# Altium project FMC_ADC_250M_16B_4ch.PrjPCB (part 3 of 4)

## Sheet Clock_Distribution.SchDoc
size A3
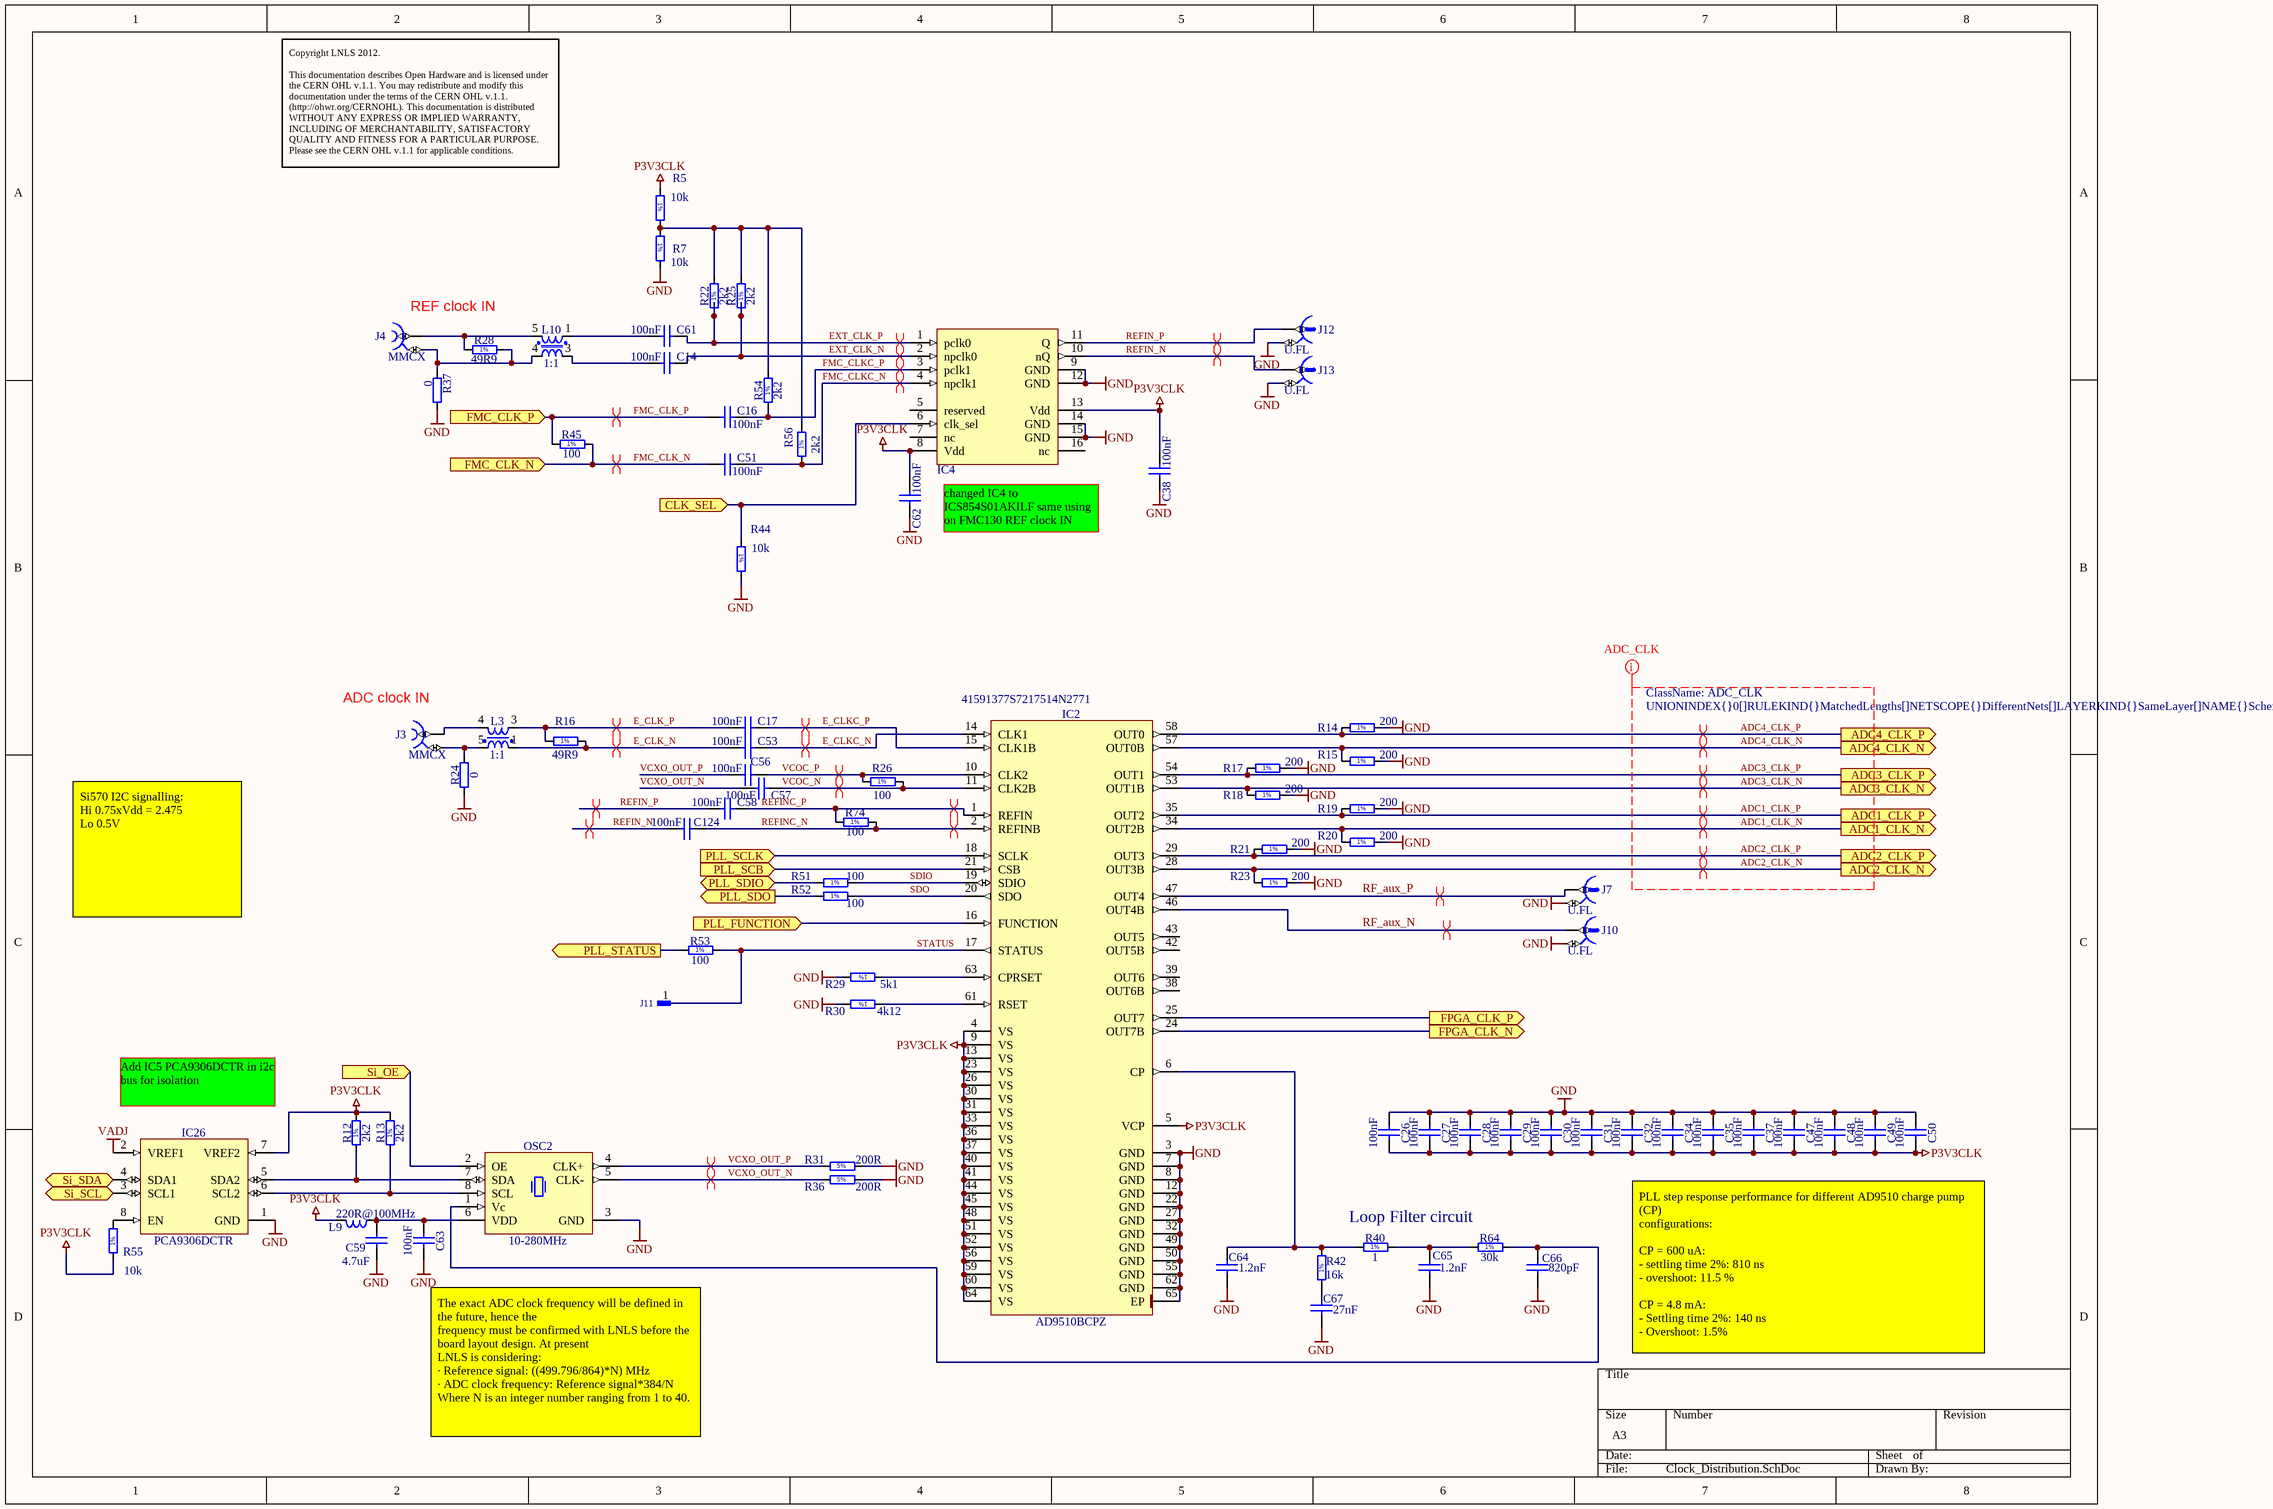
[diagram p5: Clock_Distribution.SchDoc]

### Parts
C14  100nF  [CAPC0603X33N]
C16  100nF  [CAPC0603X33N]
C17  100nF  [CAPC0603X33N]
C26  100nF  [CAPC0603X33N]
C27  100nF  [CAPC0603X33N]
C28  100nF  [CAPC0603X33N]
C29  100nF  [CAPC0603X33N]
C30  100nF  [CAPC0603X33N]
C31  100nF  [CAPC0603X33N]
C32  100nF  [CAPC0603X33N]
C34  100nF  [CAPC0603X33N]
C35  100nF  [CAPC0603X33N]
C37  100nF  [CAPC0603X33N]
C38  100nF  [CAPC0603X33N]
C47  100nF  [CAPC0603X33N]
C48  100nF  [CAPC0603X33N]
C49  100nF  [CAPC0603X33N]
C50  100nF  [CAPC0603X33N]
C51  100nF  [CAPC0603X33N]
C53  100nF  [CAPC0603X33N]
C56  100nF  [CAPC0603X33N]
C57  100nF  [CAPC0603X33N]
C58  100nF  [CAPC0603X33N]
C59  4.7uF  [CAPC1608X90N]
C61  100nF  [CAPC0603X33N]
C62  100nF  [CAPC0603X33N]
C63  100nF  [CAPC0603X33N]
C64  1.2nF  [CAPC1608X87N]
C65  1.2nF  [CAPC1608X87N]
C66  820pF  [CAPC1608X87N]
C67  27nF  [CAPC1608X87N]
C124  100nF  [CAPC0603X33N]
IC2  AD9510BCPZ  Supplier Part Number 1: 41591377S7217514N2771  [QFN50P900X900X100-65N-S485]
IC4  ICS854S01AKILF  [QFN50P300x300x100-17N-S140]  (value not drawn)
IC26  PCA9306DCTR  [SOP65P400X130-8N]
J3  MMCX  [HUBER-SUHNER_85_MMCX-50-0-1/111_OH]
J4  MMCX  [HUBER-SUHNER_85_MMCX-50-0-1/111_OH]
J7  U.FL  [HIROSE_U.FL-R-SMT-1(10)]
J10  U.FL  [HIROSE_U.FL-R-SMT-1(10)]
J11  SMD Pad  [R400X300]  (value not drawn)
J12  U.FL  [HIROSE_U.FL-R-SMT-1(10)]
J13  U.FL  [HIROSE_U.FL-R-SMT-1(10)]
L3  1:1  [XFMR_MA-COM_SM-22 (H260)]
L9  220R@100MHz  [INDC1005X55N]
L10  1:1  [XFMR_MA-COM_SM-22 (H260)]
OSC2  10-280MHz  [OSC_SILICON-LAB_SI571]
R5  10k  [RESC1005X40N]
R7  10k  [RESC1005X40N]
R12  2k2  [RESC1005X40N]
R13  2k2  [RESC1005X40N]
R14  200  [RESC1005X40N]
R15  200  [RESC1005X40N]
R16  49R9  [RESC1005X40N]
R17  200  [RESC1005X40N]
R18  200  [RESC1005X40N]
R19  200  [RESC1005X40N]
R20  200  [RESC1005X40N]
R21  200  [RESC1005X40N]
R22  2k2  [RESC1005X40N]
R23  200  [RESC1005X40N]
R24  0  [RESC0603X28N]
R25  2k2  [RESC1005X40N]
R26  100  [RESC1005X40N]
R28  49R9  [RESC1005X40N]
R29  5k1  [RESC1005X40N]
R30  4k12  [RESC1005X40N]
R31  200R  [RESC1005X40N]
R36  200R  [RESC1005X40N]
R37  0  [RESC0603X28N]
R40  1  [RESC1005X40N]
R42  16k  [RESC1608X55N]
R44  10k  [RESC1005X40N]
R45  100  [RESC1005X40N]
R51  100  [RESC1005X40N]
R52  100  [RESC1005X40N]
R53  100  [RESC1005X40N]
R54  2k2  [RESC1005X40N]
R55  10k  [RESC1005X40N]
R56  2k2  [RESC1005X40N]
R64  30k  [RESC1608X55N]
R74  100  [RESC1005X40N]

### Ports
ADC1_CLK_N (out), ADC1_CLK_P (out), ADC2_CLK_N (out), ADC2_CLK_P (out), ADC3_CLK_N (out), ADC3_CLK_P (out), ADC4_CLK_N (out), ADC4_CLK_P (out), CLK_SEL (in), FMC_CLK_N (in), FMC_CLK_P (in), FPGA_CLK_N (out), FPGA_CLK_P (out), PLL_FUNCTION (in), PLL_SCB (in), PLL_SCLK (in), PLL_SDIO (bidir), PLL_SDO (out), PLL_STATUS (out), Si_OE (in), Si_SCL (in), Si_SDA (bidir)

### Nets
GND: C26.1 C27.1 C28.1 C29.1 C30.1 C31.1 C32.1 C34.1 C35.1 C37.1 C38.1 C47.1 C48.1 C49.1 C50.1 C59.1 C62.1 C63.2 C64.1 C65.1 C66.1 C67.1 IC2.3(GND) IC2.7(GND) IC2.8(GND) IC2.12(GND) IC2.22(GND) IC2.27(GND) IC2.32(GND) IC2.49(GND) IC2.50(GND) IC2.55(GND) IC2.62(GND) IC2.65(EP) IC4.9(GND) IC4.12(GND) IC4.14(GND) IC4.15(GND) IC26.1(GND) J7.2 J10.2 J12.2 J13.2 OSC2.3(GND) R7.2 R14.2 R15.2 R17.2 R18.2 R19.2 R20.2 R21.2 R23.2 R24.1 R29.2 R30.2 R31.2 R36.2 R37.2 R44.2
P3V3CLK: C26.2 C27.2 C28.2 C29.2 C30.2 C31.2 C32.2 C34.2 C35.2 C37.2 C38.2 C47.2 C48.2 C49.2 C50.2 C62.2 IC2.4(VS) IC2.5(VCP) IC2.9(VS) IC2.13(VS) IC2.23(VS) IC2.26(VS) IC2.30(VS) IC2.31(VS) IC2.33(VS) IC2.36(VS) IC2.37(VS) IC2.40(VS) IC2.41(VS) IC2.44(VS) IC2.45(VS) IC2.48(VS) IC2.51(VS) IC2.52(VS) IC2.56(VS) IC2.59(VS) IC2.60(VS) IC2.64(VS) IC4.8(Vdd) IC4.13(Vdd) IC26.7(VREF2) L9.2 R5.1 R12.2 R13.2 R55.1
VADJ: IC26.2(VREF1)
ADC1_CLK_N: IC2.34(OUT2B) R20.1 ; port ADC1_CLK_N
ADC1_CLK_P: IC2.35(OUT2) R19.1 ; port ADC1_CLK_P
ADC2_CLK_N: IC2.28(OUT3B) R23.1 ; port ADC2_CLK_N
ADC2_CLK_P: IC2.29(OUT3) R21.1 ; port ADC2_CLK_P
ADC3_CLK_N: IC2.53(OUT1B) R18.1 ; port ADC3_CLK_N
ADC3_CLK_P: IC2.54(OUT1) R17.1 ; port ADC3_CLK_P
ADC4_CLK_N: IC2.57(OUT0B) R15.1 ; port ADC4_CLK_N
ADC4_CLK_P: IC2.58(OUT0) R14.1 ; port ADC4_CLK_P
CLK_SEL: IC4.6(clk_sel) R44.1 ; port CLK_SEL
E_CLK_N: C53.2 L3.1 R16.2
E_CLK_P: C17.2 L3.3 R16.1
E_CLKC_N: C53.1 IC2.14(CLK1)
E_CLKC_P: C17.1 IC2.15(CLK1B)
EXT_CLK_N: C14.1 IC4.2(npclk0) R25.1
EXT_CLK_P: C61.1 IC4.1(pclk0) R22.1
FMC_CLK_N: C51.2 R45.2 ; port FMC_CLK_N
FMC_CLK_P: C16.2 R45.1 ; port FMC_CLK_P
FMC_CLKC_N: C51.1 IC4.4(npclk1) R56.1
FMC_CLKC_P: C16.1 IC4.3(pclk1) R54.1
FPGA_CLK_N: IC2.24(OUT7B) ; port FPGA_CLK_N
FPGA_CLK_P: IC2.25(OUT7) ; port FPGA_CLK_P
PLL_FUNCTION: IC2.16(FUNCTION) ; port PLL_FUNCTION
PLL_SCB: IC2.21(CSB) ; port PLL_SCB
PLL_SCLK: IC2.18(SCLK) ; port PLL_SCLK
PLL_SDIO: R51.1 ; port PLL_SDIO
PLL_SDO: R52.1 ; port PLL_SDO
PLL_STATUS: R53.1 ; port PLL_STATUS
REFIN_N: C124.2 IC4.10(nQ) J13.1
REFIN_P: C58.2 IC4.11(Q) J12.1
REFINC_N: C124.1 IC2.2(REFINB) R74.2
REFINC_P: C58.1 IC2.1(REFIN) R74.1
RF_aux_N: IC2.46(OUT4B) J10.1
RF_aux_P: IC2.47(OUT4) J7.1
SDIO: IC2.19(SDIO) R51.2
SDO: IC2.20(SDO) R52.2
Si_OE: OSC2.2(OE) ; port Si_OE
Si_SCL: IC26.3(SCL1) ; port Si_SCL
Si_SDA: IC26.4(SDA1) ; port Si_SDA
STATUS: IC2.17(STATUS) J11.1 R53.2
VCOC_N: C57.1 IC2.11(CLK2B) R26.2
VCOC_P: C56.1 IC2.10(CLK2) R26.1
VCXO_OUT_N: C57.2 OSC2.5(CLK-) R36.1
VCXO_OUT_P: C56.2 OSC2.4(CLK+) R31.1
NetC14_2: C14.2 L10.3
NetC59_2: C59.2 C63.1 L9.1 OSC2.6(VDD)
NetC61_2: C61.2 L10.1
NetC64_2: C64.2 IC2.6(CP) R40.1 R42.2
NetC65_2: C65.2 R40.2 R64.1
NetC66_2: C66.2 OSC2.1(Vc) R64.2
NetC67_2: C67.2 R42.1
NetIC2_61: IC2.61(RSET) R30.1
NetIC2_63: IC2.63(CPRSET) R29.1
NetIC26_5: IC26.5(SDA2) OSC2.7(SDA) R12.1
NetIC26_6: IC26.6(SCL2) OSC2.8(SCL) R13.1
NetIC26_8: IC26.8(EN) R55.2
NetJ3_1: J3.1 L3.4
NetJ3_2: J3.2 L3.5 R24.2
NetJ4_1: J4.1 L10.5 R28.1
NetJ4_2: J4.2 L10.4 R28.2 R37.1
NetR5_2: R5.2 R7.1 R22.2 R25.2 R54.2 R56.2

Not connected (* = marked no-connect by the designer): IC2 38(OUT6B) 39(OUT6) 42(OUT5B) 43(OUT5); IC4 5(reserved) 7(nc) 16(nc)

### Layout directives
differential pair: ADC1_CLK_N, ADC1_CLK_P, ADC2_CLK_N, ADC2_CLK_P, ADC3_CLK_N, ADC3_CLK_P, ADC4_CLK_N, ADC4_CLK_P, E_CLK_N, E_CLK_P, E_CLKC_N, E_CLKC_P, EXT_CLK_N, EXT_CLK_P, FMC_CLK_N, FMC_CLK_P, FMC_CLKC_N, FMC_CLKC_P, REFIN_N, REFIN_P, REFINC_N, REFINC_P, RF_aux_N, RF_aux_P, VCOC_N, VCOC_P, VCXO_OUT_N, VCXO_OUT_P
net class ADC_CLK; rule Matched Net Lengths [Tolerance = 0.5mm]: ADC1_CLK_N, ADC1_CLK_P, ADC2_CLK_N, ADC2_CLK_P, ADC3_CLK_N, ADC3_CLK_P, ADC4_CLK_N, ADC4_CLK_P

### Notes on the sheet
- Copyright LNLS 2012.
  This documentation describes Open Hardware and is licensed under the CERN OHL v.1.1. You may redistribute and modify this documentation under the terms of the CERN OHL v.1.1. (http://ohwr.org/CERNOHL). This documentation is distributed WITHOUT ANY EXPRESS OR IMPLIED WARRANTY, INCLUDING OF MERCHANTABILITY, SATISFACTORY QUALITY AND FITNESS FOR A PARTICULAR PURPOSE. Please see the CERN OHL v.1.1 for applicable conditions.
- REF clock IN
- changed IC4 to ICS854S01AKILF same using on FMC130 REF clock IN
- (near J3) ADC clock IN
- Si570 I2C signalling:
  Hi 0.75xVdd = 2.475
  Lo 0.5V
- (near IC26) Add IC5 PCA9306DCTR in i2c bus for isolation
- Loop Filter circuit
- PLL step response performance for different AD9510 charge pump (CP)
  configurations:
  CP = 600 uA:
  - settling time 2%: 810 ns
  - overshoot: 11.5 %
  CP = 4.8 mA:
  - Settling time 2%: 140 ns
  - Overshoot: 1.5%
- (near C63) The exact ADC clock frequency will be defined in the future, hence the
  frequency must be confirmed with LNLS before the board layout design. At present
  LNLS is considering:
  · Reference signal: ((499.796/864)*N) MHz
  · ADC clock frequency: Reference signal*384/N
  Where N is an integer number ranging from 1 to 40.
- (in symbol R0402_1R_1%_0.0625W_200PPM) 1%
- (in symbol R0402_2K2_1%_0.0625W_100PPM) 1%
- (in symbol R0402_4K12_1%_0.0625W_100PPM) 1%
- (in symbol R0402_5K1_1%_0.0625W_100PPM) 1%
- (in symbol R0402_10K_1%_0.0625W_100PPM) 1%
- (in symbol R0402_49R9_1%_0.0625W_100PPM) 1%
- (in symbol R0402_100R_1%_0.0625W_100PPM) 1%
- (in symbol R0402_200R_1%_0.0625W_100PPM) 1%
- (in symbol R0603_16K_1%_0.1W_100PPM) 1%
- (in symbol R0603_30K_1%_0.1W_100PPM) 1%

### Library data of the parts
C14 C16 C17 C26-C32 C34 C35 C37 C38 C47-C51 C53 C56-C58 C61-C63 C124 = CC0201_100NF_6.3V_10%_X5R: Non-polarised capacitor; Part Description: SMD Multilayer Chip Ceramic Capacitor; Manufacturer: GENERIC; Manufacturer1 Part Number: 02016D104KAT2A; Voltage: 6.3V; TC: X5R; Tolerance: ±10%; Table: Capacitors SMD; Part Number: CC0201_100NF_6.3V_10%_X5R; Component Kind: Standard; Component Type: Standard; Pin Count: 2; Value: 100nF; Status: Not Recommended; Manufacturer Part Number: CC0201_100NF_6.3V_10%_X5R; Case: 0201; Mounted: Yes; Socket: No; SMD: Yes; Manufacturer1 Example: AVX; Manufacturer1 ComponentHeight: 0.33mm; HelpURL: \\cern.ch\dfs\Applications\Altium\Datasheets\CC0201_X5R_AVX.pdf; Author: CERN DEM JLC; CreateDate: 03/12/2007; LatestRevisionDate: 03/12/2007; Sense: No
C59 = CC0603_4.7UF_25V_10%_X5R: Non-polarised capacitor; Part Description: SMD Multilayer Chip Ceramic Capacitor; Manufacturer: GENERIC; Manufacturer1 Part Number: GRM188R61E475KE11D; Voltage: 25V; TC: X5R; Tolerance: ±10%; Part Number: CC0603_4.7UF_25V_10%_X5R; Component Kind: Standard; Component Type: Standard; Pin Count: 2; Value: 4.7uF; Status: None; Manufacturer Part Number: CC0603_4.7UF_25V_10%_X5R; Case: 0603; Mounted: Yes; Socket: No; SMD: Yes; Manufacturer1 Example: MURATA; Manufacturer1 ComponentHeight: 0.95mm; HelpURL: \\cern.ch\dfs\Applications\Altium\Datasheets\CC0603_MURATA_GRM188R61E475KE11D.pdf; Author: CERN DEM JLC; CreateDate: 10/11/2014; LatestRevisionDate: 10/11/2014; Sense: No
C64 C65 = CC0603_1.2NF_50V_10%_X7R: Non-polarised capacitor; Part Description: SMD Multilayer Chip Ceramic Capacitor; Manufacturer: GENERIC; Manufacturer1 Part Number: 223858615624; Voltage: 50V; TC: X7R; Tolerance: ±10%; Part Number: CC0603_1.2NF_50V_10%_X7R; Component Kind: Standard; Component Type: Standard; Pin Count: 2; Value: 1.2nF; Status: Preferred; Manufacturer Part Number: CC0603_1.2NF_50V_10%_X7R; Case: 0603; Mounted: Yes; Socket: No; SMD: Yes; Manufacturer1 Example: PHYCOMP; Manufacturer1 ComponentHeight: 0.87mm; HelpURL: \\cern.ch\dfs\Applications\Altium\Datasheets\CC0603_X7R_PHYCOMP.pdf; Author: CERN DEM JLC; CreateDate: 03/12/2007; LatestRevisionDate: 03/12/2007; Sense: No
C66 = CC0603_820PF_50V_10%_X7R: Non-polarised capacitor; Part Description: SMD Multilayer Chip Ceramic Capacitor; Manufacturer: GENERIC; Manufacturer1 Part Number: 223858615622; Voltage: 50V; TC: X7R; Tolerance: ±10%; Part Number: CC0603_820PF_50V_10%_X7R; Component Kind: Standard; Component Type: Standard; Pin Count: 2; Value: 820pF; Status: Preferred; Manufacturer Part Number: CC0603_820PF_50V_10%_X7R; Case: 0603; Mounted: Yes; Socket: No; SMD: Yes; Manufacturer1 Example: PHYCOMP; Manufacturer1 ComponentHeight: 0.87mm; Author: CERN DEM JLC; CreateDate: 03/12/2007; LatestRevisionDate: 03/12/2007; Sense: No; HelpURL: \\cern.ch\dfs\Applications\Altium\Datasheets\CC0603_X7R_PHYCOMP.pdf
C67 = CC0603_27NF_25V_10%_X7R: Non-polarised capacitor; Part Description: SMD Multilayer Chip Ceramic Capacitor; Manufacturer: GENERIC; Manufacturer1 Part Number: 223891615642; Voltage: 25V; TC: X7R; Tolerance: ±10%; Part Number: CC0603_27NF_25V_10%_X7R; Component Kind: Standard; Component Type: Standard; Pin Count: 2; Value: 27nF; Status: Preferred; Manufacturer Part Number: CC0603_27NF_25V_10%_X7R; Case: 0603; Mounted: Yes; Socket: No; SMD: Yes; Manufacturer1 Example: PHYCOMP; Manufacturer1 ComponentHeight: 0.87mm; HelpURL: \\cern.ch\dfs\Applications\Altium\Datasheets\CC0603_X7R_PHYCOMP.pdf; Author: CERN DEM JLC; CreateDate: 03/12/2007; LatestRevisionDate: 03/12/2007; Sense: No
IC2 = AD9510BCPZ: 1.2 GHz Clock Distribution IC, PLL Core, Dividers, Delay Adjust, Eight Outputs; Manufacturer: ANALOG DEVICES; Table: Logic; Bonding: No; PressFit: No; Part Number: AD9510BCPZ; Component Kind: Standard; Component Type: Standard; Device: AD9510BCPZ; PackageDescription: QFN, 0.50mm Pitch, Square; 64 Pin, 9.00mm L X 9.00mm W X 1.00mm H Body (4.85 X 4.85mm Thermal Tab), IPC Medium Density; Part Description: 1.2 GHz Clock Distribution IC, PLL Core, Dividers, Delay Adjust, Eight Outputs; Manufacturer Part Number: AD9510BCPZ; Pin Count: 65; Case: QFN64; Mounted: Yes; Socket: No; SMD: Yes; ComponentHeight: 1mm; HelpURL: \\cern.ch\dfs\Applications\Altium\Datasheets\AD9510BCPZ.pdf; Author: CERN DEM JLC; CreateDate: 09/10/2012; LatestRevisionDate: 09/10/2012; Supplier 1: Arrow; Sense: No
IC4 = ICS854S01AKILF: 2:1 Differential-to-LVDS Multiplexer; Manufacturer: INTEGRATED DEVICE TECHNOLOGY (IDT); PressFit: No; Bonding: No; Manufacturer Part Number: ICS854S01AKILF; Part Number: ICS854S01AKILF; Component Kind: Standard; Component Type: Standard; Device: ICS854S01AKILF; PackageDescription: QFN, 0.50mm Pitch, Square; 16 Pin, 3.00mm L X 3.00mm W X 1.00mm H Body (w/Thermal Tab 1.00 X 1.80mm),  IPC Medium Density; Part Description: 2:1 Differential-to-LVDS Multiplexer; Pin Count: 16; Case: QFN16; Mounted: Yes; Socket: No; SMD: Yes; Sense: No; ComponentHeight: 1.0mm; Author: LNLS DIG GBMB; CreateDate: 03/06/2016; LatestRevisionDate: 03/06/2016
IC26 = PCA9306DCTR: Dual Bidirectional I2C Bus And SMBus Voltage-Level Translator; Manufacturer: TEXAS INSTRUMENTS; Table: Analog & Interface; Bonding: No; PressFit: No; Part Number: PCA9306DCTR; Component Kind: Standard; Component Type: Standard; Device: PCA9306DCTR; PackageDescription: SOP, 0.65mm, Pitch; 8 Pin, 2.80mm W X 2.95mm L X 1.30mm H Body, PC Medium Density; Part Description: Dual Bidirectional I2C Bus And SMBus Voltage-Level Translator; Manufacturer Part Number: PCA9306DCTR; Pin Count: 8; Case: SSOP8; Mounted: Yes; Socket: No; SMD: Yes; ComponentHeight: 1.3mm; Author: CERN DEM JLC; HelpURL: \\cern.ch\dfs\Applications\Altium\Datasheets\PCA9306DCTR.pdf; CreateDate: 25/02/2013; LatestRevisionDate: 11/02/2016; Sense: No
J3 J4 = HUBER-SUHNER_85_MMCX-50-0-1/111_OH: Part Description: MMCX 50 Ohms Right Angle PCB Jack; Manufacturer: HUBER+SUHNER; PressFit: No; Part Number: HUBER-SUHNER_85_MMCX-50-0-1/111_OH; Component Kind: Standard; Component Type: Standard; Pin Count: 2; Family: MMCX; Mounted: Yes; Socket: No; SMD: No; Status: None; Manufacturer Part Number: 85_MMCX-50-0-1/111_OH; ComponentHeight: 9.6mm; HelpURL: \\cern.ch\dfs\Applications\Altium\Datasheets\HUBER-SUHNER_85_MMCX-50-0-1-111_OH.pdf; Author: CERN DEM JLC; CreateDate: 04/10/2011; LatestRevisionDate: 06/11/2014; Sense: No
J7 J10 J12 J13 = HIROSE_U.FL-R-SMT-1(10): Part Description: Up to 6GHz Ultra Small Surface Mount Male Coaxial Connectors U.FL Series; Manufacturer: HIROSE (HRS); Table: Miscellaneous; PressFit: No; Part Number: HIROSE_U.FL-R-SMT-1(10); Component Kind: Standard; Component Type: Standard; Pin Count: 2; Family: U.FL; Mounted: Yes; Socket: No; SMD: Yes; Status: None; Manufacturer Part Number: U.FL-R-SMT-1(10); ComponentHeight: 1.25mm; HelpURL: \\cern.ch\dfs\Applications\Altium\Datasheets\HIROSE_U.FL-R-SMT-1(10).pdf; Author: CERN DEM JLC; CreateDate: 24/03/2010; LatestRevisionDate: 24/03/2010; Sense: No
J11 = SMD_PAD_4X3MM: Single SMD Pad; Part Description: 4mm x 3mm SMD Pad; Mounted: No; Part Number: SMD_PAD_4X3MM; Component Kind: Standard (No BOM); Component Type: Standard (No BOM); Pin Count: 1; Family: SMD Pad; Socket: No; SMD: No; Sense: No; Status: None; ComponentHeight: 0mm; HelpURL: Undefined; Author: CERN DEM JLC; CreateDate: 15/03/2010; LatestRevisionDate: 15/03/2010; PackageDescription: 4mm x  3mm SMD Pad
L3 L10 = XFMR_MA-COM_MABA-007159-000000: MA-COM E-Serie RF 1:1 Transmission Line Ttransformer 4.5-3000MHz; Part Description: RF Transmission Line Ttransformer 4.5-3000MHz (E-Serie); Manufacturer: MA-COM TECHNOLOGY; Table: Transformers; Part Number: XFMR_MA-COM_MABA-007159-000000; Component Kind: Standard; Component Type: Standard; Pin Count: 5; Value: 1:1; Status: None; Manufacturer Part Number: MABA-007159-000000; Mounted: Yes; Socket: No; SMD: Yes; ComponentHeight: 2.6mm; HelpURL: \\cern.ch\dfs\Applications\Altium\Datasheets\XFMR_MA-COM_MABA-007159-000000.pdf; Author: CERN DEM JLC; CreateDate: 03/10/2012; LatestRevisionDate: 03/10/2012; Sense: No
L9 = IND0402_MURATA_BLM15HB221SN1: Inductor; Part Description: SMD EMIFIL Suppression Chip Ferrite Bead; Manufacturer: MURATA; Power: 250mA; Resistance: 1R; Tolerance: ±25%; Table: Inductors SMD; Part Number: IND0402_MURATA_BLM15HB221SN1; Component Kind: Standard; Component Type: Standard; Pin Count: 2; Value: 220R@100MHz; Status: None; Manufacturer Part Number: BLM15HB221SN1; Case: 0402; Mounted: Yes; Socket: No; SMD: Yes; ComponentHeight: 0.55mm; HelpURL: \\cern.ch\dfs\Applications\Altium\Datasheets\IND0402_MURATA_BLM15H.pdf; Author: CERN DEM JLC; CreateDate: 23/06/2009; LatestRevisionDate: 23/06/2009; Sense: No
OSC2 = OSC_10-280MHZ_SILICON-LAB_Si571AJC000337DG: Any-Rate I2C Programmable XO Oscillator Si571 Serie; Part Description: 10-280MHz 3.3V ±20ppm LVPECL, I2C Programmable VCXO Oscillator Si571 Series; Manufacturer: SILICON LABS; Bonding: No; PressFit: No; Part Number: OSC_10-280MHZ_SILICON-LAB_Si571AJC000337DG; Component Kind: Standard; Component Type: Standard; PackageDescription: Oscillator Si571 Series, 8 pins, 5x7mm; Value: 10-280MHz; Manufacturer Part Number: Si571AJC000337DG; Pin Count: 8; Mounted: Yes; Socket: No; SMD: Yes; ComponentHeight: 1.85mm; HelpURL: \\cern.ch\dfs\Applications\Altium\Datasheets\OSC_SILICON-LAB_SI571.pdf; Author: CERN DEM JLC; CreateDate: 07/07/2014; LatestRevisionDate: 07/07/2014; Sense: No
R5 R7 R44 R55 = R0402_10K_1%_0.0625W_100PPM: Resistor - 1%; Part Description: General Purpose Thick Film Chip Resistor; Manufacturer: GENERIC; Manufacturer1 Part Number: 232270671003L; TC: ±100ppm/°C; LatestRevisionDate: 17/10/2012; Part Number: R0402_10K_1%_0.0625W_100PPM; Component Kind: Standard; Component Type: Standard; Pin Count: 2; Value: 10k; Status: Not recommended; Power: 0.0625W; Tolerance: ±1%; Manufacturer Part Number: R0402_10K_1%_0.0625W_100PPM; Case: 0402; Mounted: Yes; Sense: No; Socket: No; SMD: Yes; Manufacturer1 Example: YAGEO PHYCOMP; Manufacturer1 ComponentHeight: 0.4mm; HelpURL: \\cern.ch\dfs\Applications\Altium\Datasheets\R0402_Phycomp_RC0402.pdf; Author: CERN DEM JLC; CreateDate: 03/12/2007
R12 R13 R22 R25 R54 R56 = R0402_2K2_1%_0.0625W_100PPM: Resistor - 1%; Part Description: General Purpose Thick Film Chip Resistor; Manufacturer: GENERIC; Manufacturer1 Part Number: 232270672202L; TC: ±100ppm/°C; Table: Resistors SMD; Part Number: R0402_2K2_1%_0.0625W_100PPM; Component Kind: Standard; Component Type: Standard; Pin Count: 2; Value: 2k2; Status: Not recommended; Power: 0.0625W; Tolerance: ±1%; Manufacturer Part Number: R0402_2K2_1%_0.0625W_100PPM; Case: 0402; Mounted: Yes; Socket: No; SMD: Yes; Manufacturer1 Example: YAGEO PHYCOMP; Manufacturer1 ComponentHeight: 0.4mm; HelpURL: \\cern.ch\dfs\Applications\Altium\Datasheets\R0402_Phycomp_RC0402.pdf; Author: CERN DEM JLC; CreateDate: 03/12/2007; LatestRevisionDate: 17/10/2012; Sense: No
R14 R15 R17-R21 R23 = R0402_200R_1%_0.0625W_100PPM: Resistor - 1%; Part Description: General Purpose Thick Film Chip Resistor; Manufacturer: GENERIC; Manufacturer1 Part Number: 232270672001L; TC: ±100ppm/°C; Table: Resistors SMD; Part Number: R0402_200R_1%_0.0625W_100PPM; Component Kind: Standard; Component Type: Standard; Pin Count: 2; Value: 200; Status: Not recommended; Power: 0.0625W; Tolerance: ±1%; Manufacturer Part Number: R0402_200R_1%_0.0625W_100PPM; Case: 0402; Mounted: Yes; Socket: No; SMD: Yes; Manufacturer1 Example: YAGEO PHYCOMP; Manufacturer1 ComponentHeight: 0.4mm; HelpURL: \\cern.ch\dfs\Applications\Altium\Datasheets\R0402_Phycomp_RC0402.pdf; Author: CERN DEM JLC; CreateDate: 03/12/2007; LatestRevisionDate: 17/10/2012; Sense: No
R16 R28 = R0402_49R9_1%_0.0625W_100PPM: Resistor - 1%; Part Description: General Purpose Thick Film Chip Resistor; Manufacturer: GENERIC; Manufacturer1 Part Number: 232270674999L or RC0402FR-0749R9L; TC: ±100ppm/°C; Part Number: R0402_49R9_1%_0.0625W_100PPM; Component Kind: Standard; Component Type: Standard; Pin Count: 2; Value: 49R9; Status: Not recommended; Power: 0.0625W; Tolerance: ±1%; Manufacturer Part Number: R0402_49R9_1%_0.0625W_100PPM; Case: 0402; Mounted: Yes; Sense: No; Socket: No; SMD: Yes; Manufacturer1 Example: YAGEO PHYCOMP; Manufacturer1 ComponentHeight: 0.4mm; HelpURL: \\cern.ch\dfs\Applications\Altium\Datasheets\R0402_Phycomp_RC0402.pdf; Author: CERN DEM JLC; CreateDate: 24/10/2012; LatestRevisionDate: 24/10/2012
R24 R37 = R0201_0R_JUMPER: Resistor; Part Description: 1A (0.05R Max DC Resistance) Zero Ohm Jumper; Manufacturer: GENERIC; Manufacturer1 Part Number: CRCW02010000Z0ED; Mounted: No; Part Number: R0201_0R_JUMPER; Component Kind: Standard; Component Type: Standard; Pin Count: 2; Value: 0; Status: Not recommended; Manufacturer Part Number: R0201_0R_JUMPER; Case: 0201; Sense: No; Socket: No; SMD: Yes; Manufacturer1 Example: VISHAY; Manufacturer1 ComponentHeight: 0.27mm; HelpURL: \\cern.ch\dfs\Applications\Altium\Datasheets\R0201_VISHAY_CRCW e3.pdf; Author: CERN DEM JLC; CreateDate: 19/11/2014; LatestRevisionDate: 08/01/2015
R26 R51-R53 = R0402_100R_1%_0.0625W_100PPM: Resistor - 1%; Part Description: General Purpose Thick Film Chip Resistor; Manufacturer: GENERIC; Manufacturer1 Part Number: 232270671001L; TC: ±100ppm/°C; Table: Resistors SMD; Part Number: R0402_100R_1%_0.0625W_100PPM; Component Kind: Standard; Component Type: Standard; Pin Count: 2; Value: 100; Status: Not recommended; Power: 0.0625W; Tolerance: ±1%; Manufacturer Part Number: R0402_100R_1%_0.0625W_100PPM; Case: 0402; Mounted: Yes; Socket: No; SMD: Yes; Manufacturer1 Example: YAGEO PHYCOMP; Manufacturer1 ComponentHeight: 0.4mm; HelpURL: \\cern.ch\dfs\Applications\Altium\Datasheets\R0402_Phycomp_RC0402.pdf; Author: CERN DEM JLC; CreateDate: 03/12/2007; LatestRevisionDate: 17/10/2012; Sense: No
R29 = R0402_5K1_1%_0.0625W_100PPM: Resistor - 1%; Part Description: General Purpose Thick Film Chip Resistor; Manufacturer: GENERIC; Manufacturer1 Part Number: 232270675102L; TC: ±100ppm/°C; Part Number: R0402_5K1_1%_0.0625W_100PPM; Component Kind: Standard; Component Type: Standard; Pin Count: 2; Value: 5k1; Status: Not recommended; Power: 0.0625W; Tolerance: ±1%; Manufacturer Part Number: R0402_5K1_1%_0.0625W_100PPM; Case: 0402; Mounted: Yes; Sense: No; Socket: No; SMD: Yes; Manufacturer1 Example: YAGEO PHYCOMP; Manufacturer1 ComponentHeight: 0.4mm; HelpURL: \\cern.ch\dfs\Applications\Altium\Datasheets\R0402_Phycomp_RC0402.pdf; Author: CERN DEM JLC; CreateDate: 03/12/2007; LatestRevisionDate: 17/10/2012
R30 = R0402_4K12_1%_0.0625W_100PPM: Resistor - 1%; Part Description: General Purpose Thick Film Chip Resistor; Manufacturer: GENERIC; Manufacturer1 Part Number: 232270674122L or RC0402FR-074K12L; TC: ±100ppm/°C; Part Number: R0402_4K12_1%_0.0625W_100PPM; Component Kind: Standard; Component Type: Standard; Pin Count: 2; Value: 4k12; Status: Not recommended; Power: 0.0625W; Tolerance: ±1%; Manufacturer Part Number: R0402_4K12_1%_0.0625W_100PPM; Case: 0402; Mounted: Yes; Sense: No; Socket: No; SMD: Yes; Manufacturer1 Example: YAGEO PHYCOMP; Manufacturer1 ComponentHeight: 0.4mm; HelpURL: \\cern.ch\dfs\Applications\Altium\Datasheets\R0402_Phycomp_RC0402.pdf; Author: CERN DEM JLC; CreateDate: 24/10/2012; LatestRevisionDate: 24/10/2012
R31 R36 = R0402_200R_5%_0.0625W_100PPM: Resistor - 5%; Part Description: Surface Mount; Manufacturer: Generic; Manufacturer1 Part Number: Undefined; TC: ±100ppm/°C; Part Number: R0402_200R_5%_0.0625W_100PPM; Component Kind: Standard; Component Type: Standard; Pin Count: 2; Value: 200R; Status: Preferred; Tolerance: 5%; Manufacturer Part Number: R0402_200R_5%_0.0625W_100PPM; Case: 0402; Mounted: Yes; Sense: No; Socket: No; SMD: Yes; ComponentHeight: 0.35mm; Manufacturer1 Example: Undefined; Manufacturer1 ComponentHeight: Undefined; HelpURL: Undefined; Author: CERN DEM JLC; CreateDate: 03/12/2007; LatestRevisionDate: 13/03/2008
R40 = R0402_1R_1%_0.0625W_200PPM: Resistor - 1%; Part Description: General Purpose Thick Film Chip Resistor; Manufacturer: GENERIC; Manufacturer1 Part Number: 232270671008L; TC: ±200ppm/°C; Table: Resistors SMD; Part Number: R0402_1R_1%_0.0625W_200PPM; Component Kind: Standard; Component Type: Standard; Pin Count: 2; Value: 1; Status: Not recommended; Power: 0.0625W; Tolerance: ±1%; Manufacturer Part Number: R0402_1R_1%_0.0625W_200PPM; Case: 0402; Mounted: Yes; Socket: No; SMD: Yes; Manufacturer1 Example: YAGEO PHYCOMP; Manufacturer1 ComponentHeight: 0.4mm; HelpURL: \\cern.ch\dfs\Applications\Altium\Datasheets\R0402_Phycomp_RC0402.pdf; Author: CERN DEM JLC; CreateDate: 03/12/2007; LatestRevisionDate: 17/10/2012; Sense: No
R42 = R0603_16K_1%_0.1W_100PPM: Resistor - 1%; Part Description: General Purpose Thick Film Chip Resistor; Manufacturer: GENERIC; Manufacturer1 Part Number: NRC06F1602TRF; Power: 0.1W; TC: ±100ppm/°C; Part Number: R0603_16K_1%_0.1W_100PPM; Component Kind: Standard; Component Type: Standard; Pin Count: 2; Value: 16k; Status: Preferred; Tolerance: ±1%; Manufacturer Part Number: R0603_16K_1%_0.1W_100PPM; Case: 0603; Mounted: Yes; Socket: No; SMD: Yes; Manufacturer1 Example: NIC COMPONENT; Manufacturer1 ComponentHeight: 0.55mm; HelpURL: \\cern.ch\dfs\Applications\Altium\Datasheets\R0603_NIC_NRC.pdf; Author: CERN DEM JLC; CreateDate: 03/12/2007; LatestRevisionDate: 13/03/2008; Sense: No
R45 R74 = R0402_100R_1%_0.0625W_100PPM: Resistor - 1%; Part Description: General Purpose Thick Film Chip Resistor; Manufacturer: GENERIC; Manufacturer1 Part Number: 232270671001L; TC: ±100ppm/°C; Value: 100; LatestRevisionDate: 17/10/2012; Part Number: R0402_100R_1%_0.0625W_100PPM; Component Kind: Standard; Component Type: Standard; Pin Count: 2; Status: Not recommended; Power: 0.0625W; Tolerance: ±1%; Manufacturer Part Number: R0402_100R_1%_0.0625W_100PPM; Case: 0402; Mounted: Yes; Sense: No; Socket: No; SMD: Yes; Manufacturer1 Example: YAGEO PHYCOMP; Manufacturer1 ComponentHeight: 0.4mm; HelpURL: \\cern.ch\dfs\Applications\Altium\Datasheets\R0402_Phycomp_RC0402.pdf; Author: CERN DEM JLC; CreateDate: 03/12/2007
R64 = R0603_30K_1%_0.1W_100PPM: Resistor - 1%; Part Description: General Purpose Thick Film Chip Resistor; Manufacturer: GENERIC; Manufacturer1 Part Number: NRC06F3002TRF; Power: 0.1W; TC: ±100ppm/°C; Part Number: R0603_30K_1%_0.1W_100PPM; Component Kind: Standard; Component Type: Standard; Pin Count: 2; Value: 30k; Status: Preferred; Tolerance: ±1%; Manufacturer Part Number: R0603_30K_1%_0.1W_100PPM; Case: 0603; Mounted: Yes; Socket: No; SMD: Yes; Manufacturer1 Example: NIC COMPONENT; Manufacturer1 ComponentHeight: 0.55mm; HelpURL: \\cern.ch\dfs\Applications\Altium\Datasheets\R0603_NIC_NRC.pdf; Author: CERN DEM JLC; CreateDate: 03/12/2007; LatestRevisionDate: 13/03/2008; Sense: No